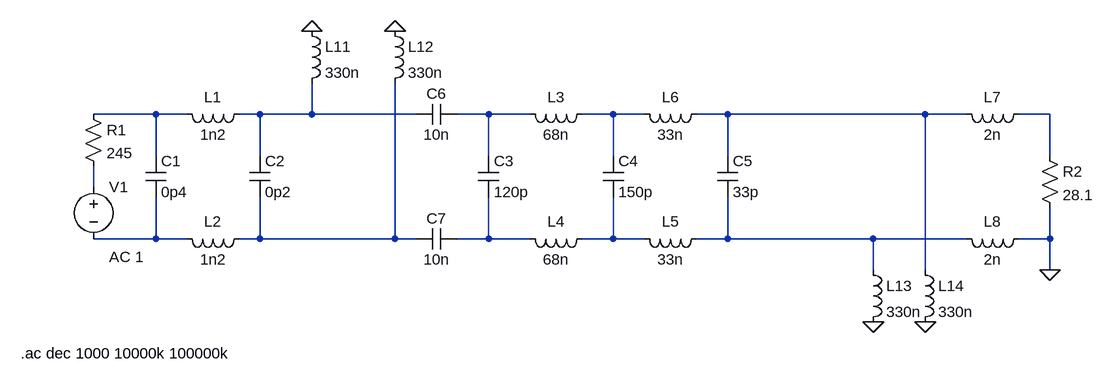
[diagram p0: schematic IF1Filter.asc]
IF1Filter.asc, the LTspice schematic file:
Version 4
SHEET 1 1628 680
WIRE 176 32 80 32
WIRE 224 32 176 32
WIRE 336 32 304 32
WIRE 416 32 416 -16
WIRE 416 32 336 32
WIRE 576 32 416 32
WIRE 688 32 640 32
WIRE 752 32 688 32
WIRE 880 32 832 32
WIRE 928 32 880 32
WIRE 1056 32 1008 32
WIRE 1360 32 1056 32
WIRE 1424 32 1360 32
WIRE 1552 32 1504 32
WIRE 176 96 176 32
WIRE 336 96 336 32
WIRE 688 96 688 32
WIRE 880 96 880 32
WIRE 1056 96 1056 32
WIRE 1552 96 1552 32
WIRE 80 144 80 112
WIRE 176 224 176 160
WIRE 176 224 80 224
WIRE 224 224 176 224
WIRE 336 224 336 160
WIRE 336 224 304 224
WIRE 544 224 544 -16
WIRE 544 224 336 224
WIRE 576 224 544 224
WIRE 688 224 688 160
WIRE 688 224 640 224
WIRE 752 224 688 224
WIRE 880 224 880 160
WIRE 880 224 832 224
WIRE 928 224 880 224
WIRE 1056 224 1056 160
WIRE 1056 224 1008 224
WIRE 1280 224 1056 224
WIRE 1424 224 1280 224
WIRE 1552 224 1552 176
WIRE 1552 224 1504 224
WIRE 1280 272 1280 224
WIRE 1360 272 1360 32
WIRE 1552 272 1552 224
FLAG 1552 272 0
FLAG 416 -96 0
FLAG 544 -96 0
FLAG 1280 352 0
FLAG 1360 352 0
SYMBOL voltage 80 128 R0
WINDOW 123 24 124 Left 2
WINDOW 39 0 0 Left 2
SYMATTR InstName V1
SYMATTR Value ""
SYMATTR Value2 AC 1
SYMBOL res 64 16 R0
SYMATTR InstName R1
SYMATTR Value 245
SYMBOL cap 160 96 R0
SYMATTR InstName C1
SYMATTR Value 0p4
SYMBOL ind 320 16 R90
WINDOW 0 5 56 VBottom 2
WINDOW 3 32 56 VTop 2
SYMATTR InstName L1
SYMATTR Value 1n2
SYMBOL ind 320 208 R90
WINDOW 0 5 56 VBottom 2
WINDOW 3 32 56 VTop 2
SYMATTR InstName L2
SYMATTR Value 1n2
SYMBOL cap 320 96 R0
SYMATTR InstName C2
SYMATTR Value 0p2
SYMBOL cap 672 96 R0
SYMATTR InstName C3
SYMATTR Value 120p
SYMBOL ind 848 16 R90
WINDOW 0 5 56 VBottom 2
WINDOW 3 32 56 VTop 2
SYMATTR InstName L3
SYMATTR Value 68n
SYMBOL ind 848 208 R90
WINDOW 0 5 56 VBottom 2
WINDOW 3 32 56 VTop 2
SYMATTR InstName L4
SYMATTR Value 68n
SYMBOL ind 1024 208 R90
WINDOW 0 5 56 VBottom 2
WINDOW 3 32 56 VTop 2
SYMATTR InstName L5
SYMATTR Value 33n
SYMBOL ind 1024 16 R90
WINDOW 0 5 56 VBottom 2
WINDOW 3 32 56 VTop 2
SYMATTR InstName L6
SYMATTR Value 33n
SYMBOL cap 864 96 R0
SYMATTR InstName C4
SYMATTR Value 150p
SYMBOL cap 1040 96 R0
SYMATTR InstName C5
SYMATTR Value 33p
SYMBOL res 1536 80 R0
SYMATTR InstName R2
SYMATTR Value 28.1
SYMBOL ind 1520 16 R90
WINDOW 0 5 56 VBottom 2
WINDOW 3 32 56 VTop 2
SYMATTR InstName L7
SYMATTR Value 2n
SYMBOL ind 1520 208 R90
WINDOW 0 5 56 VBottom 2
WINDOW 3 32 56 VTop 2
SYMATTR InstName L8
SYMATTR Value 2n
SYMBOL ind 400 -112 R0
SYMATTR InstName L11
SYMATTR Value 330n
SYMBOL ind 528 -112 R0
SYMATTR InstName L12
SYMATTR Value 330n
SYMBOL ind 1264 256 R0
SYMATTR InstName L13
SYMATTR Value 330n
SYMBOL ind 1344 256 R0
SYMATTR InstName L14
SYMATTR Value 330n
SYMBOL cap 640 16 R90
WINDOW 0 0 32 VBottom 2
WINDOW 3 32 32 VTop 2
SYMATTR InstName C6
SYMATTR Value 10n
SYMBOL cap 640 208 R90
WINDOW 0 0 32 VBottom 2
WINDOW 3 32 32 VTop 2
SYMATTR InstName C7
SYMATTR Value 10n
TEXT -32 400 Left 2 !.ac dec 1000 10000k 100000k

The netlist it stands for:
* IF1Filter.asc
V1 N007 N008 AC 1
R1 N001 N007 245
C1 N001 N008 0p4
L1 N002 N001 1n2
L2 N009 N008 1n2
C2 N002 N009 0p2
C3 N003 N010 120p
L3 N004 N003 68n
L4 N011 N010 68n
L5 N012 N011 33n
L6 N005 N004 33n
C4 N004 N011 150p
C5 N005 N012 33p
R2 N006 0 28.1
L7 N006 N005 2n
L8 0 N012 2n
L11 0 N002 330n
L12 0 N009 330n
L13 N012 0 330n
L14 N005 0 330n
C6 N003 N002 10n
C7 N010 N009 10n
.ac dec 1000 10000k 100000k
.backanno
.end